# EAGLE schematic BGA-4_3.5mm (EAGLE 9.6.2)
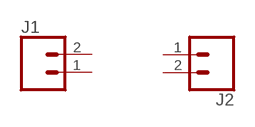
[diagram p0: schematic, sheet 1]

## Parts
J1  CONN_02  [1X02]
J2  CONN_02  [1X02]
Unconnected: J1.1 J1.2 J2.1 J2.2

## Library data of the parts
J1 J2 = bschulz:CONN_02: Genaric 2 terminal header SCREW_2.54 <https://www.digikey.com/product-detail/en/on-shore-technology-inc/OSTVN02A150/ED10561-ND/1588862> 39532_RA <https://www.digikey.com/product-detail/en/molex/0395321002/WM7845-ND/1280696>